# Altium project XC7A35T底板.PrjPcb
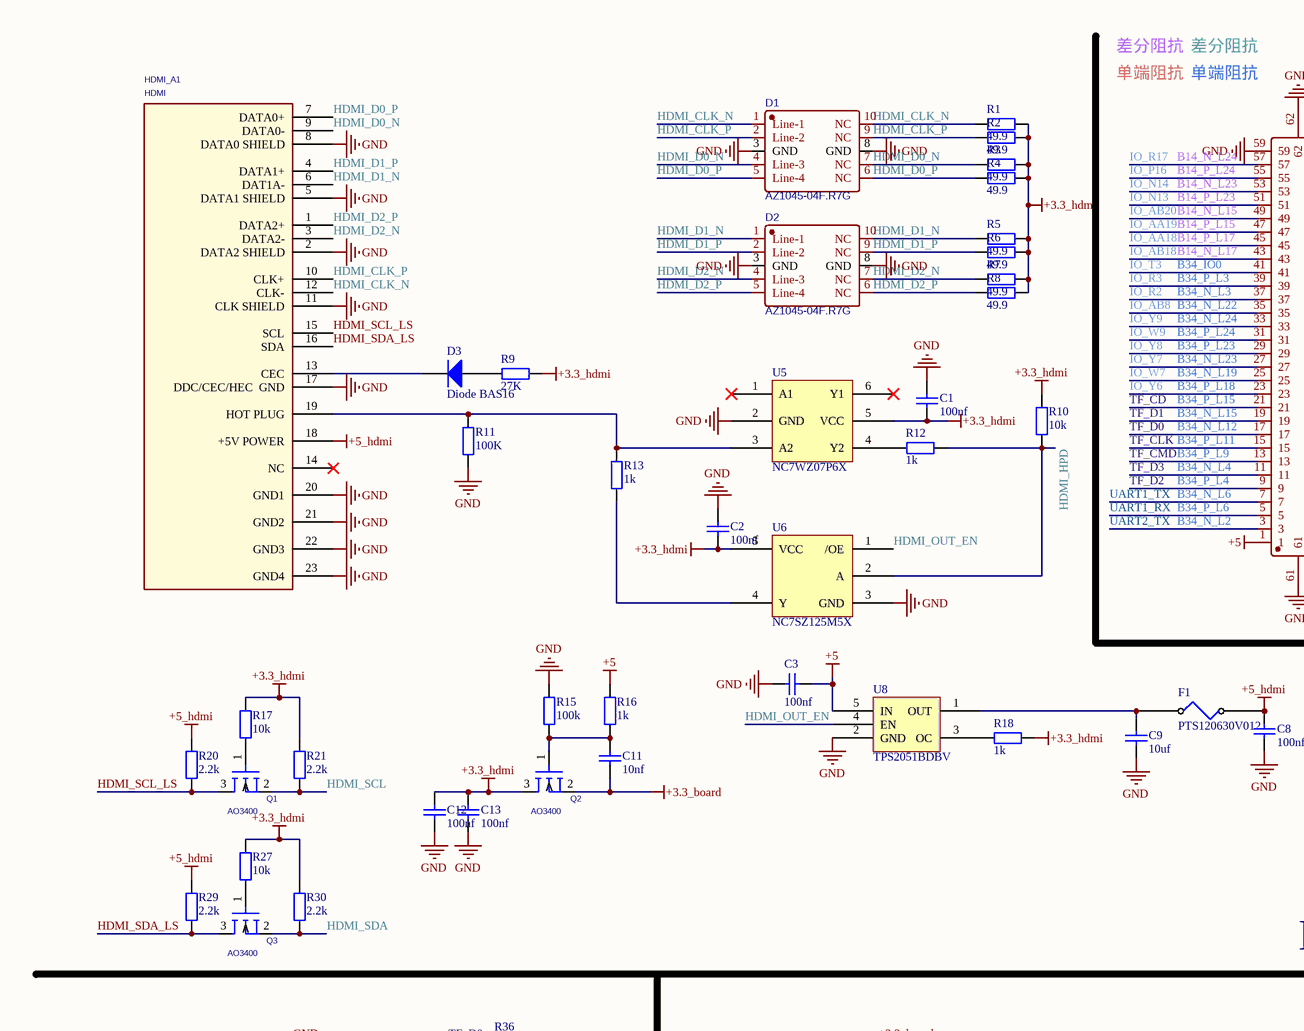
[diagram p0: Sheet1.SchDoc, top left]
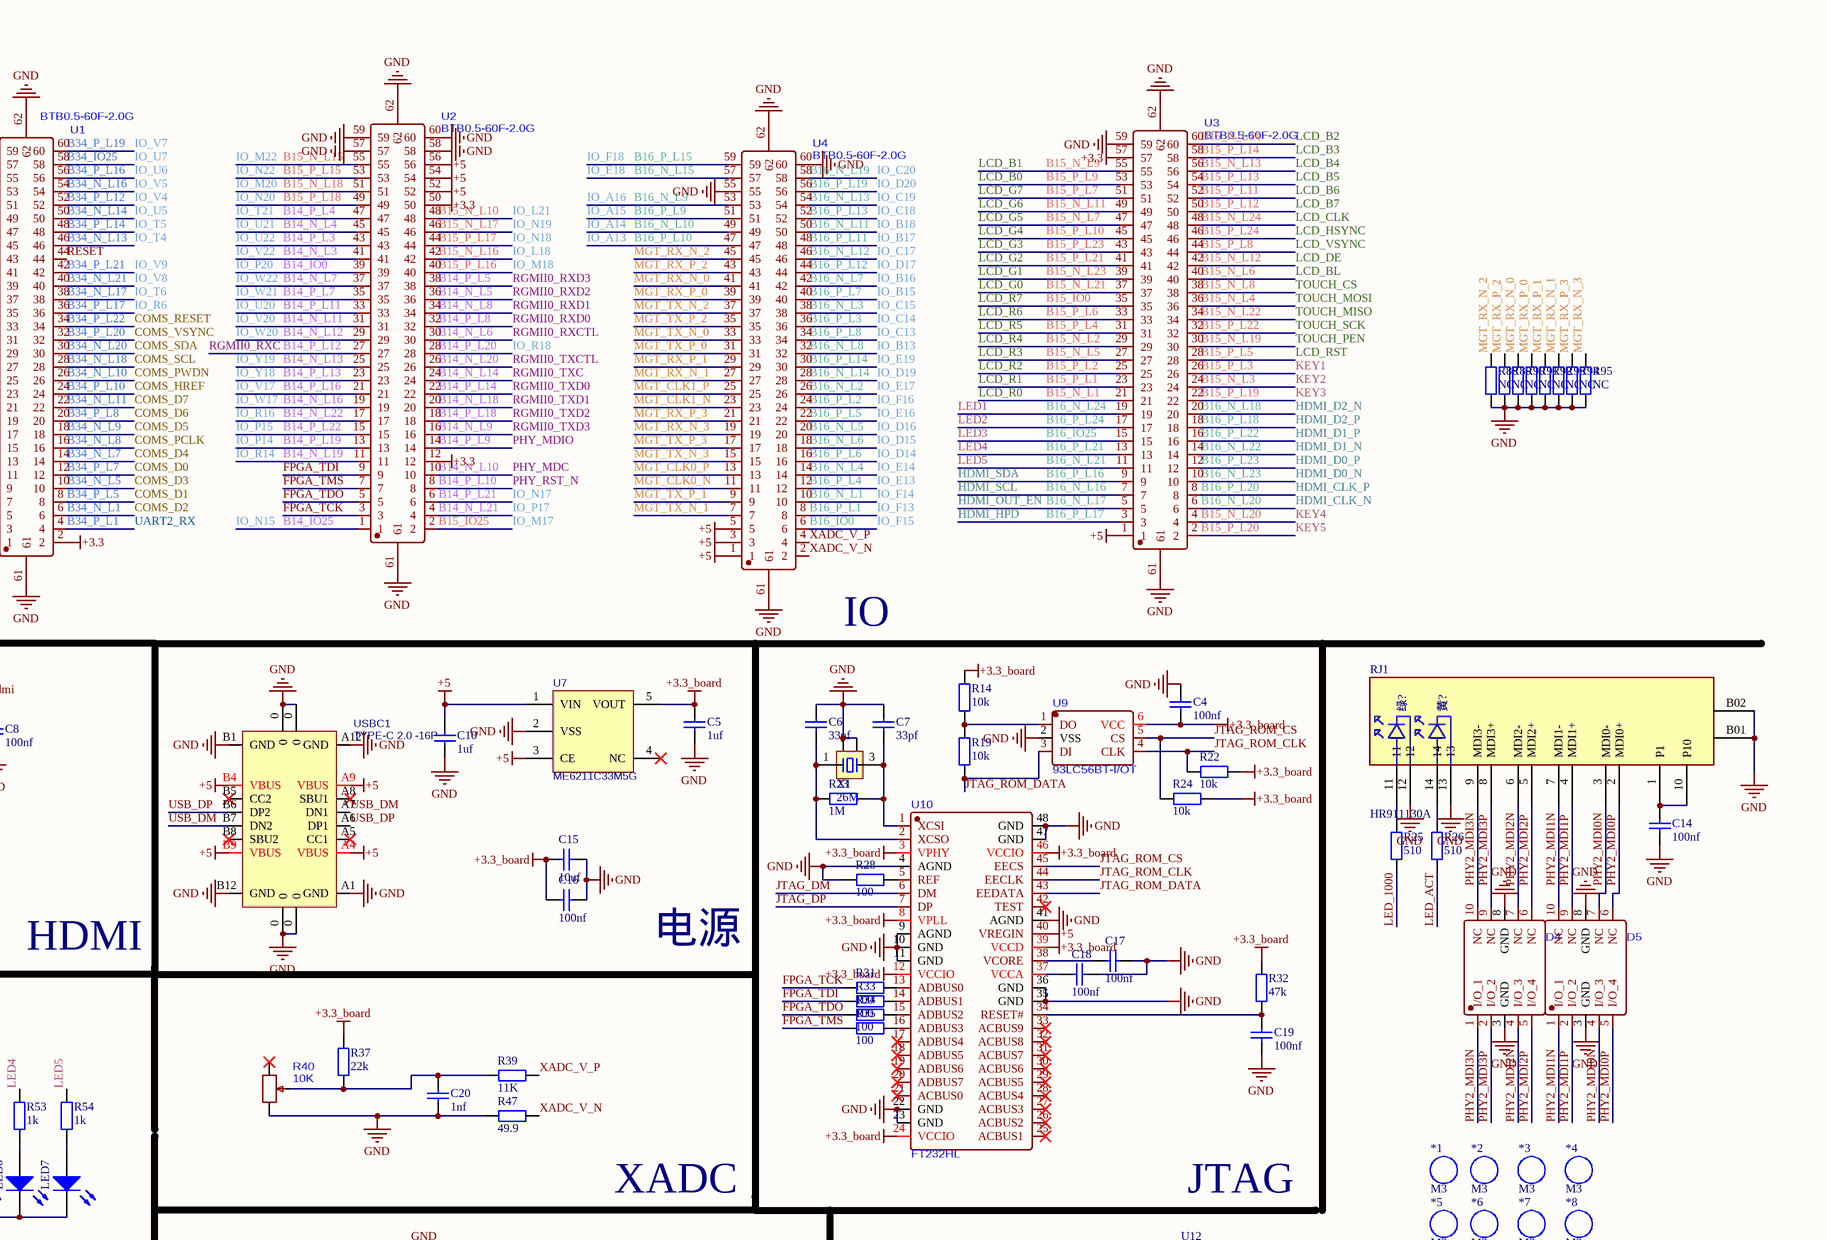
[diagram p1: Sheet1.SchDoc, top right]
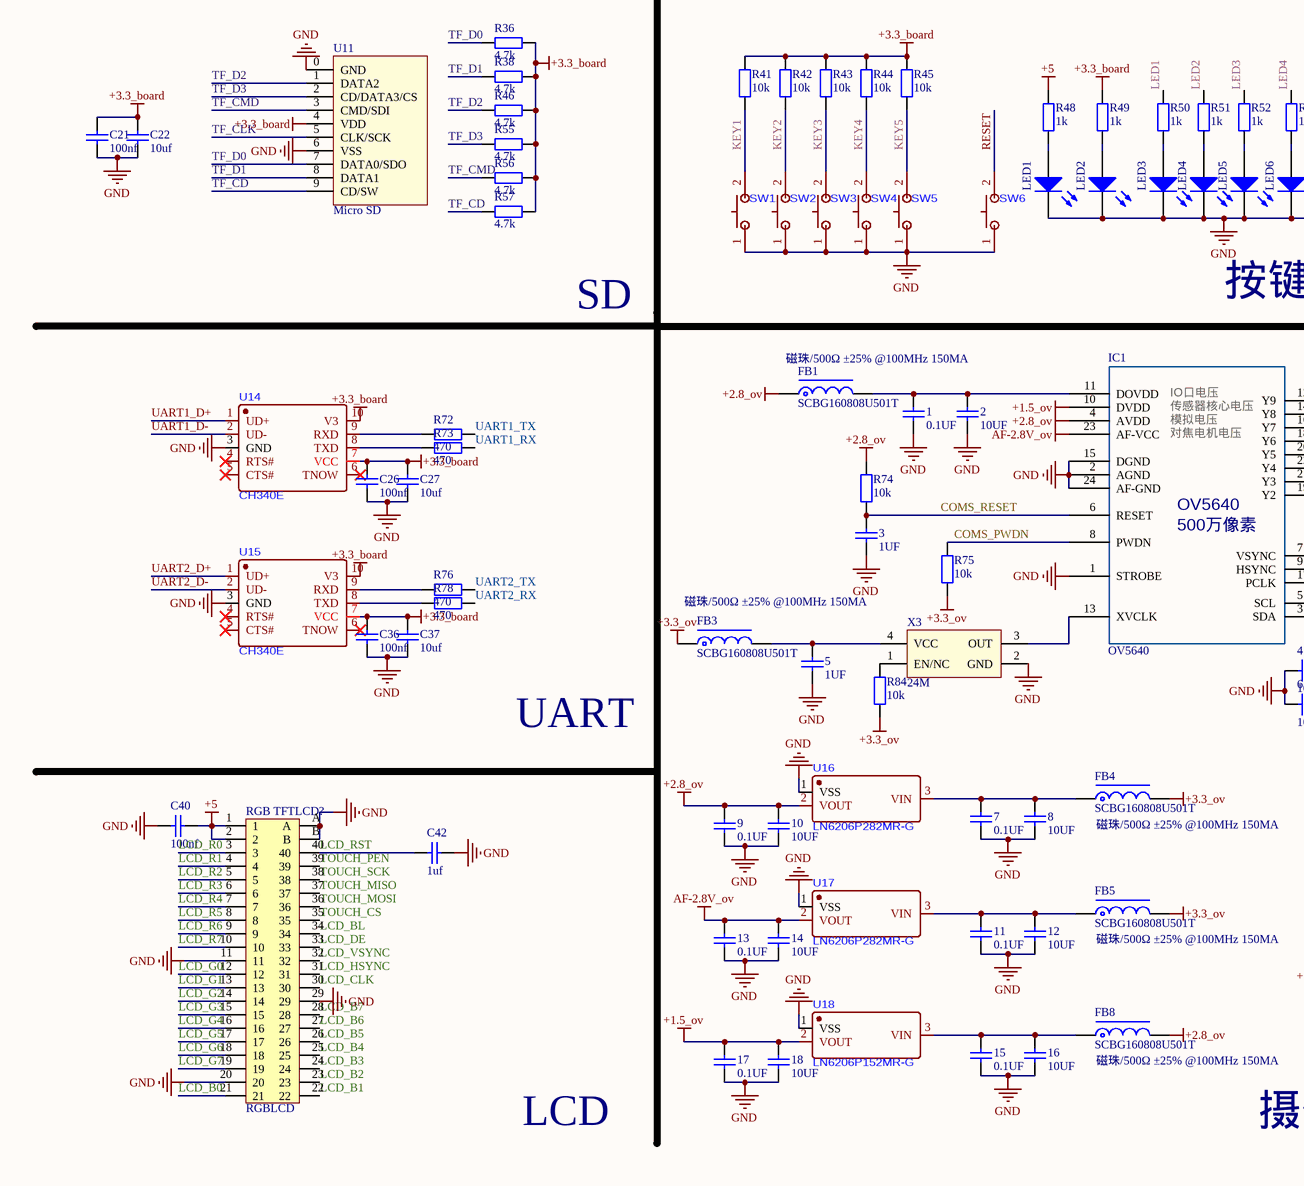
[diagram p2: Sheet1.SchDoc, bottom left]
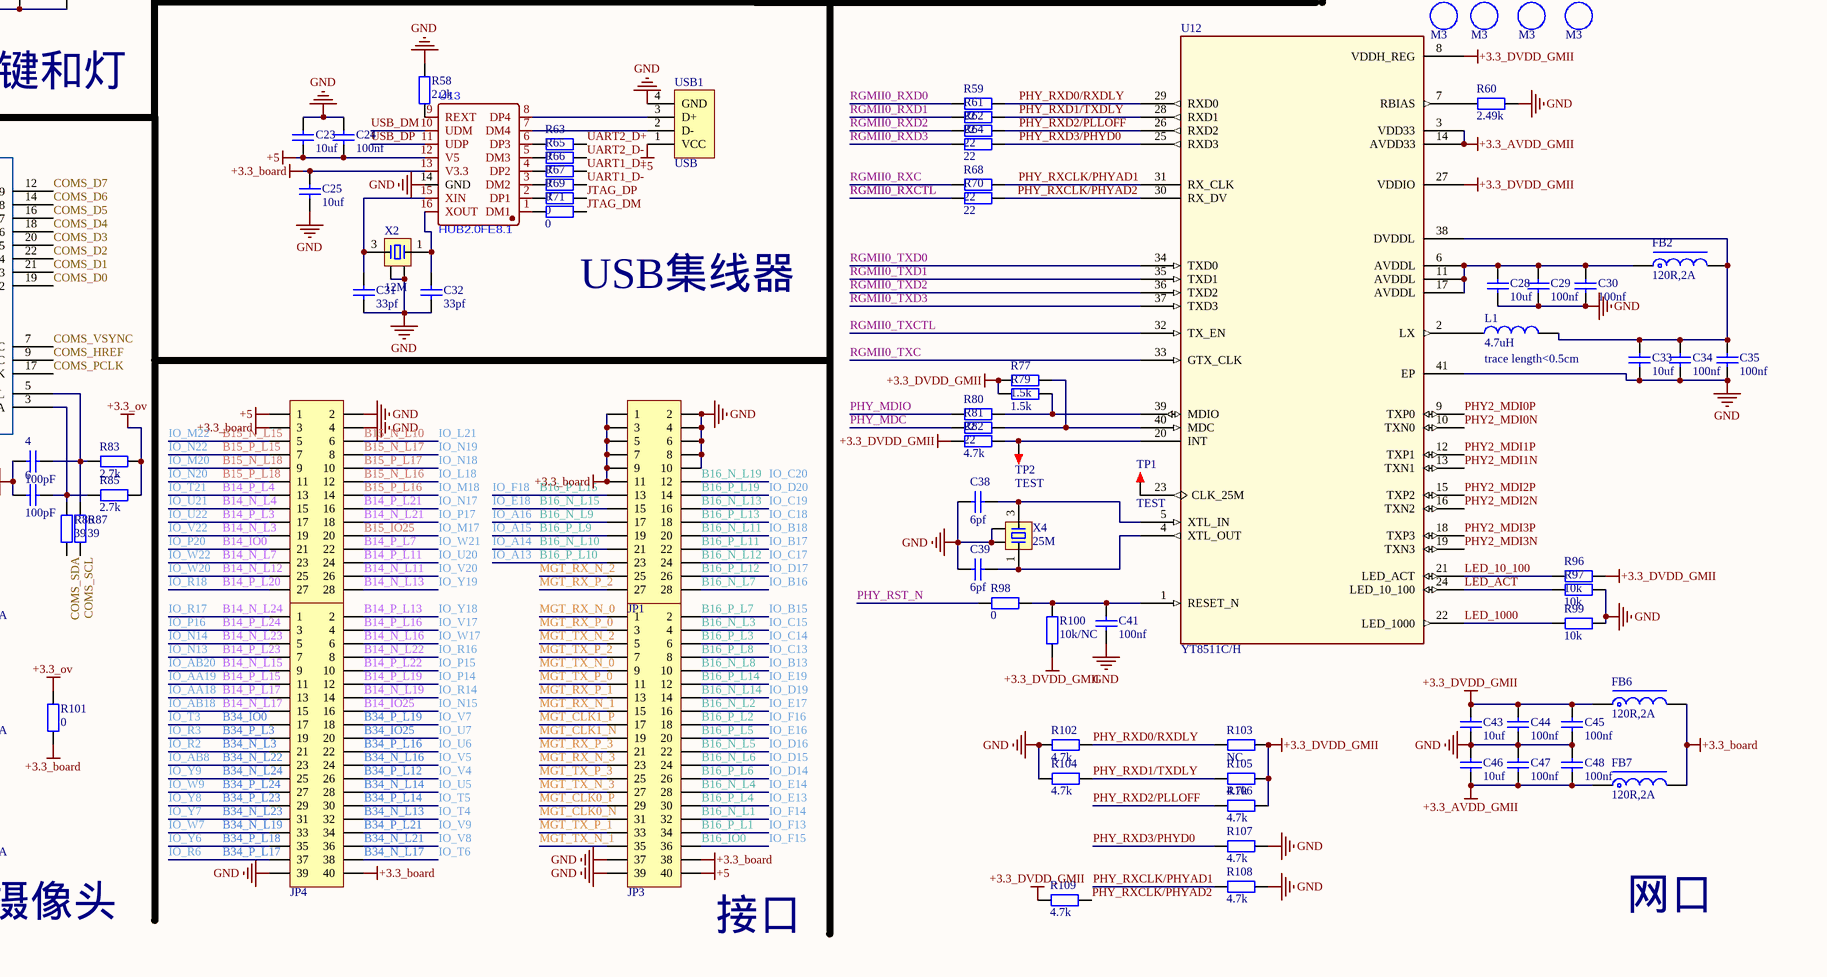
[diagram p3: Sheet1.SchDoc, bottom right]
1 sheet, 248 parts. Net scope: global (net labels, ports and power ports of the same name join across sheets).
Board file: PCB1.PcbDoc

## Sheet Sheet1.SchDoc
size A2; SheetNumber: 1; SheetTotal: 1

### Parts
1  0.1UF  [C0603_L]
2  10UF  [C0603_L]
3  1UF  [C0603_L]
4  100pF  [C0603_L]
5  1UF  [C0603_L]
6  100pF  [C0603_L]
7  0.1UF  [C0603_L]
8  10UF  [C0603_L]
9  0.1UF  [C0603_L]
10  10UF  [C0603_L]
11  0.1UF  [C0603_L]
12  10UF  [C0603_L]
13  0.1UF  [C0603_L]
14  10UF  [C0603_L]
15  0.1UF  [C0603_L]
16  10UF  [C0603_L]
17  0.1UF  [C0603_L]
18  10UF  [C0603_L]
*1  M3  [M3 125X200]
*2  M3  [M3 125X200]
*3  M3  [M3 125X200]
*4  M3  [M3 125X200]
*5  M3  [M3 125X200]
*6  M3  [M3 125X200]
*7  M3  [M3 125X200]
*8  M3  [M3 125X200]
C1  100nf  [C0603_L]
C2  100nf  [C0603_L]
C3  100nf  [C0603_L]
C4  100nf  [C0603_L]
C5  1uf  [C0603_L]
C6  33pf  [C0603_L]
C7  33pf  [C0603_L]
C8  100nf  [C0603_L]
C9  10uf  [C0603_L]
C10  1uf  [C0603_L]
C11  10nf  [C0603_L]
C12  100nf  [C0603_L]
C13  100nf  [C0603_L]
C14  100nf  [C0402_L]
C15  10uf  [C0603_L]
C16  100nf  [C0603_L]
C17  100nf  [C0603_L]
C18  100nf  [C0603_L]
C19  100nf  [C0603_L]
C20  1nf  [C0603_L]
C21  100nf  [C0603_L]
C22  10uf  [C0603_L]
C23  10uf  [C0603_L]
C24  100nf  [C0603_L]
C25  10uf  [C0603_L]
C26  100nf  [C0603_L]
C27  10uf  [C0603_L]
C28  10uf  [C0402_L]
C29  100nf  [C0402_L]
C30  100nf  [C0402_L]
C31  33pf  [C0603_L]
C32  33pf  [C0603_L]
C33  10uf  [C0402_L]
C34  100nf  [C0402_L]
C35  100nf  [C0402_L]
C36  100nf  [C0603_L]
C37  10uf  [C0603_L]
C38  6pf  [C0402_L]
C39  6pf  [C0402_L]
C40  100nf  [C0603_L]
C41  100nf  [C0402_L]
C42  1uf  [C0603_L]
C43  10uf  [C0603_L]
C44  100nf  [C0402_L]
C45  100nf  [C0402_L]
C46  10uf  [C0603_L]
C47  100nf  [C0402_L]
C48  100nf  [C0402_L]
D1  AZ1045-04F.R7G  [DFN2510P10E]
D2  AZ1045-04F.R7G  [DFN2510P10E]
D3  Diode BAS16  [SOT-23_N]
D4  AZ1143-04F_C42377645  [DFN-10_L2.5-W1.0-P0.50-BL-A]  (value not drawn)
D5  AZ1143-04F_C42377645  [DFN-10_L2.5-W1.0-P0.50-BL-A]  (value not drawn)
F1  PTS120630V012  [FU 1206]
FB1  SCBG160808U501T  [FB0603]
FB2  120R,2A  [FB0603]
FB3  SCBG160808U501T  [FB0603]
FB4  SCBG160808U501T  [FB0603]
FB5  SCBG160808U501T  [FB0603]
FB6  120R,2A  [FB0603]
FB7  120R,2A  [FB0603]
FB8  SCBG160808U501T  [FB0603]
HDMI_A1  HDMI  [HDMI_SMD_A]
IC1  OV5640  [OV2640]
JP1  Header 2X11  [HDR2.54-LI-2x14P]  (value not drawn)
JP2  Header 2X11  [HDR2.54-LI-2x14P]  (value not drawn)
JP3  Header 2X11  [HDR2.54-LI-2x20P]  (value not drawn)
JP4  Header 2X11  [HDR2.54-LI-2x20P]  (value not drawn)
L1  4.7uH  [L0805]
LED1  绿色  [LED0805_G]  (value not drawn)
LED2  绿色  [LED0805_G]  (value not drawn)
LED3  绿色  [LED0805_G]  (value not drawn)
LED4  绿色  [LED0805_G]  (value not drawn)
LED5  绿色  [LED0805_G]  (value not drawn)
LED6  绿色  [LED0805_G]  (value not drawn)
LED7  绿色  [LED0805_G]  (value not drawn)
Q1  AO3400  [SOT23]
Q2  AO3400  [SOT23]
Q3  AO3400  [SOT23]
R1  49.9  [R0402_M]
R2  49.9  [R0402_M]
R3  49.9  [R0402_M]
R4  49.9  [R0402_M]
R5  49.9  [R0402_M]
R6  49.9  [R0402_M]
R7  49.9  [R0402_M]
R8  49.9  [R0402_M]
R9  27K  [R0603_L]
R10  10k  [R0603_L]
R11  100K  [R0603_L]
R12  1k  [R0603_L]
R13  1k  [R0603_L]
R14  10k  [R0603_L]
R15  100k  [R0603_L]
R16  1k  [R0603_L]
R17  10k  [R0603_L]
R18  1k  [R0603_L]
R19  10k  [R0603_L]
R20  2.2k  [R0603_L]
R21  2.2k  [R0603_L]
R22  10k  [R0603_L]
R23  1M  [R0603_L]
R24  10k  [R0603_L]
R25  510  [R0402_L]
R26  510  [R0402_L]
R27  10k  [R0603_L]
R28  100  [R0603_L]
R29  2.2k  [R0603_L]
R30  2.2k  [R0603_L]
R31  100  [R0603_L]
R32  47k  [R0603_L]
R33  100  [R0603_L]
R34  100  [R0603_L]
R35  100  [R0603_L]
R36  4.7k  [R0603_L]
R37  22k  [R0603_L]
R38  4.7k  [R0603_L]
R39  11K  [R0603_L]
R40  10K  [RV09_RV0932]
R41  10k  [R0603_L]
R42  10k  [R0603_L]
R43  10k  [R0603_L]
R44  10k  [R0603_L]
R45  10k  [R0603_L]
R46  4.7k  [R0603_L]
R47  49.9  [R0603_L]
R48  1k  [R0603_L]
R49  1k  [R0603_L]
R50  1k  [R0603_L]
R51  1k  [R0603_L]
R52  1k  [R0603_L]
R53  1k  [R0603_L]
R54  1k  [R0603_L]
R55  4.7k  [R0603_L]
R56  4.7k  [R0603_L]
R57  4.7k  [R0603_L]
R58  2.2k  [R0603_L]
R59  22  [R0402_L]
R60  2.49k  [R0402_L]
R61  22  [R0402_L]
R62  22  [R0402_L]
R63  0  [R0603_L]
R64  22  [R0402_L]
R65  0  [R0603_L]
R66  0  [R0603_L]
R67  0  [R0603_L]
R68  22  [R0402_L]
R69  0  [R0603_L]
R70  22  [R0402_L]
R71  0  [R0603_L]
R72  470  [R0603_L]
R73  470  [R0603_L]
R74  10k  [R0603_L]
R75  10k  [R0603_L]
R76  470  [R0603_L]
R77  1.5k  [R0402_L]
R78  470  [R0603_L]
R79  1.5k  [R0402_L]
R80  22  [R0402_L]
R81  22  [R0402_L]
R82  4.7k  [R0402_L]
R83  2.7k  [R0603_L]
R84  10k  [R0603_L]
R85  2.7k  [R0603_L]
R86  39  [R0603_L]
R87  39  [R0603_L]
R88  NC  [R0402_L]
R89  NC  [R0402_L]
R90  NC  [R0402_L]
R91  NC  [R0402_L]
R92  NC  [R0402_L]
R93  NC  [R0402_L]
R94  NC  [R0402_L]
R95  NC  [R0402_L]
R96  10k  [R0402_L]
R97  10k  [R0402_L]
R98  0  [R0402_L]
R99  10k  [R0402_L]
R100  10k/NC  [R0402_L]
R101  0  [R0805_L]
R102  4.7k  [R0402_L]
R103  NC  [R0402_L]
R104  4.7k  [R0402_L]
R105  4.7k  [R0402_L]
R106  4.7k  [R0402_L]
R107  4.7k  [R0402_L]
R108  4.7k  [R0402_L]
R109  4.7k  [R0402_L]
RGB_TFTLCD?  RGBLCD  [FPC-TOP40]
RJ1  HR911130A  [HR911130C_RJ45]
SW1  GT-TC029B-H020-L1N  [SW-SMD_L3.9-W2.9-P4.15-LS5.0]  (value not drawn)
SW2  GT-TC029B-H020-L1N  [SW-SMD_L3.9-W2.9-P4.15-LS5.0]  (value not drawn)
SW3  GT-TC029B-H020-L1N  [SW-SMD_L3.9-W2.9-P4.15-LS5.0]  (value not drawn)
SW4  GT-TC029B-H020-L1N  [SW-SMD_L3.9-W2.9-P4.15-LS5.0]  (value not drawn)
SW5  GT-TC029B-H020-L1N  [SW-SMD_L3.9-W2.9-P4.15-LS5.0]  (value not drawn)
SW6  GT-TC029B-H020-L1N  [SW-SMD_L3.9-W2.9-P4.15-LS5.0]  (value not drawn)
TP1  TEST  [TEST 1.6]
TP2  TEST  [TEST 1.6]
U1  BTB0.5-60F-2.0G  [CONN-SMD_60P-P0.50_BTB0.5-60F-2.0G]
U2  BTB0.5-60F-2.0G  [CONN-SMD_60P-P0.50_BTB0.5-60F-2.0G]
U3  BTB0.5-60F-2.0G  [CONN-SMD_60P-P0.50_BTB0.5-60F-2.0G]
U4  BTB0.5-60F-2.0G  [CONN-SMD_60P-P0.50_BTB0.5-60F-2.0G]
U5  NC7WZ07P6X  [NC7WZ07P6X]
U6  NC7SZ125M5X  [NC7SZ125M5X]
U7  ME6211C33M5G  [SOT-23-5]
U8  TPS2051BDBV  [TPS2051BDBV]
U9  93LC56BT-I/OT  [SOT-23-6_L2.9-W1.6-P0.95-LS2.8-BR]
U10  FT232HL  [LQFP-48_L7.0-W7.0-P0.50-LS9.0-TL]
U11  Micro SD  [Micro SD]
U12  YT8511C/H  [QFN40 5X5_N]
U13  HUB2.0FE8.1  [SSOP-16_L4.9-W3.9-P0.64-LS6.0-BL]
U14  CH340E  [MSOP-10_L3.0-W3.0-P0.50-LS5.0-BL]
U15  CH340E  [MSOP-10_L3.0-W3.0-P0.50-LS5.0-BL]
U16  LN6206P282MR-G  [SOT-23-3_L2.9-W1.3-P1.90-LS2.4-BR]
U17  LN6206P282MR-G  [SOT-23-3_L2.9-W1.3-P1.90-LS2.4-BR]
U18  LN6206P152MR-G  [SOT-23-3_L2.9-W1.3-P1.90-LS2.4-BR]
USB1  USB  [USB2.0_Type-A_DIP_F_1]
USBC1  TYPE-C 2.0 -16P  [USB-C-SMD_16P]
X1  26M  [XTAL-3225-4P]
X2  12M  [XTAL-3225-4P]
X3  24M  [OSC-3225-4P]
X4  25M  [XTAL-3225-4P]

### Nets
+1.5_ov: 17.2 18.2 IC1.10(DVDD) U18.2(VOUT)
+2.8_ov: 9.2 10.2 FB1.1 FB8.2 IC1.4(AVDD) R74.1 U16.2(VOUT)
+3.3: U1.2 U2.12 U2.50 U3.57
+3.3_AVDD_GMII: C46.2 C47.2 C48.2 FB7.1 U12.3(VDD33) U12.14(AVDD33)
+3.3_board: C4.2 C5.2 C11.1 C15.2 C16.2 C21.2 C22.2 C25.1 C26.2 C27.2 C36.2 C37.2 FB6.2 FB7.2 JP1.1 JP1.3 JP1.5 JP1.7 JP1.9 JP1.11 JP2.3 JP3.38 JP4.40 Q2.2(S) R14.2 R22.1 R24.1 R32.2 R36.2 R37.2 R38.2 R41.2 R42.2 R43.2 R44.2 R45.2 R46.2 R49.2 R55.2 R56.2 R57.2 R101.1 U7.5(VOUT) U9.6(VCC) U10.3(VPHY) U10.8(VPLL) U10.12(VCCIO) U10.24(VCCIO) U10.39(VCCD) U10.46(VCCIO) U11.4(VDD) U13.13(V3.3) U14.7(VCC) U14.10(V3) U15.7(VCC) U15.10(V3)
+3.3_DVDD_GMII: C43.1 C44.1 C45.1 FB6.1 R77.1 R79.1 R82.1 R96.2 R100.1 R103.2 R105.2 R106.2 R109.1 U12.8(VDDH_REG) U12.27(VDDIO)
+3.3_hdmi: C1.1 C2.2 C12.2 C13.2 Q2.3(D) R1.2 R2.2 R3.2 R4.2 R5.2 R6.2 R7.2 R8.2 R9.2 R10.2 R17.1 R18.1 R21.1 R27.1 R30.1 U5.5(VCC) U6.5(VCC)
+3.3_ov: FB3.1 FB4.2 FB5.2 R75.2 R83.2 R84.2 R85.2 R101.2
+5: C3.2 C10.2 C23.2 C24.2 C40.2 JP2.1 JP3.40 R16.2 R48.2 RGB_TFTLCD?.1 RGB_TFTLCD?.2 U1.1 U2.52 U2.54 U2.56 U3.1 U4.1 U4.3 U4.5 U7.1(VIN) U7.3(CE) U8.5(IN) U10.40(VREGIN) U13.12(V5) USB1.1(VCC) USBC1.A4(VBUS) USBC1.A9(VBUS) USBC1.B4(VBUS) USBC1.B9(VBUS)
+5_hdmi: C8.2 F1.2 HDMI_A1.18(+5V_POWER) R20.1 R29.1
AF-2.8V_ov: 13.2 14.2 IC1.23(AF-VCC) U17.2(VOUT)
GND: 1.1 2.1 3.1 4.1 5.1 6.1 7.1 8.1 9.1 10.1 11.1 12.1 13.1 14.1 15.1 16.1 17.1 18.1 C1.2 C2.1 C3.1 C4.1 C5.1 C6.2 C7.2 C8.1 C9.1 C10.1 C12.1 C13.1 C14.2 C15.1 C16.1 C17.2 C18.2 C19.1 C20.2 C21.1 C22.1 C23.1 C24.1 C25.2 C26.1 C27.1 C28.1 C29.1 C30.1 C31.2 C32.2 C33.1 C34.1 C35.1 C36.1 C37.1 C38.1 C39.1 C40.1 C41.1 C42.2 C43.2 C44.2 C45.2 C46.1 C47.1 C48.1 D1.3(GND) D1.8(GND) D2.3(GND) D2.8(GND) D4.3(GND) D4.8(GND) D5.3(GND) D5.8(GND) HDMI_A1.2(DATA2_SHIELD) HDMI_A1.5(DATA1_SHIELD) HDMI_A1.8(DATA0_SHIELD) HDMI_A1.11(CLK_SHIELD) HDMI_A1.17(DDC/CEC/HEC__GND) HDMI_A1.20(GND1) HDMI_A1.21(GND2) HDMI_A1.22(GND3) HDMI_A1.23(GND4) IC1.1(STROBE) IC1.2(AGND) IC1.15(DGND) IC1.24(AF-GND) JP1.2 JP1.4 JP1.6 JP1.8 JP1.10 JP2.2 JP2.4 JP3.37 JP3.39 JP4.39 LED1.2(K) LED2.2(K) LED3.2(K) LED4.2(K) LED5.2(K) LED6.2(K) LED7.2(K) R11.1 R15.1 R28.1 R40.1 R47.1 R58.1 R60.2 R88.1 R89.1 R90.1 R91.1 R92.1 R93.1 R94.1 R95.1 R97.2 R99.2 R102.1 R104.1 R107.2 R108.2 RGB_TFTLCD?.11 RGB_TFTLCD?.20 RGB_TFTLCD?.29 RGB_TFTLCD?.A RGB_TFTLCD?.B RJ1.12 RJ1.13 RJ1.B01 RJ1.B02 SW1.1 SW2.1 SW3.1 SW4.1 SW5.1 SW6.1 U1.59 U1.61 U1.62 U2.57 U2.58 U2.59 U2.60 U2.61 U2.62 U3.59 U3.61 U3.62 U4.55 U4.60 U4.61 U4.62 U5.2(GND) U6.3(GND) U7.2(VSS) U8.2(GND) U9.2(VSS) U10.4(AGND) U10.9(AGND) U10.10(GND) U10.11(GND) U10.22(GND) U10.23(GND) U10.35(GND) U10.36(GND) U10.41(AGND) U10.47(GND) U10.48(GND) U11.0(GND) U11.6(VSS) U12.41(EP) U13.14(GND) U14.3(GND) U15.3(GND) U16.1(VSS) U17.1(VSS) U18.1(VSS) USB1.4(GND) USBC1.0 USBC1.A1(GND) USBC1.A12(GND) USBC1.B1(GND) USBC1.B12(GND) X1.2 X1.4 X2.2 X2.4 X3.2(GND) X4.2 X4.4
B14_IO0: JP2.21 U2.39  [also labelled IO_P20]
B14_IO25: JP4.16 U2.1  [also labelled IO_N15]
B14_N_L3: JP2.19 U2.41  [also labelled IO_V22]
B14_N_L4: JP2.15 U2.45  [also labelled IO_U21]
B14_N_L5: R62.1 U2.36  [also labelled RGMII0_RXD2]
B14_N_L6: R70.1 U2.30  [also labelled RGMII0_RXCTL]
B14_N_L7: JP2.23 U2.37  [also labelled IO_W22]
B14_N_L8: R61.1 U2.34  [also labelled RGMII0_RXD1]
B14_N_L9: U2.16 U12.37(TXD3)  [also labelled RGMII0_TXD3]
B14_N_L10: R81.1 U2.10  [also labelled PHY_MDC]
B14_N_L11: JP2.26 U2.31  [also labelled IO_V20]
B14_N_L12: JP2.25 U2.29  [also labelled IO_W20]
B14_N_L13: JP2.28 U2.25  [also labelled IO_Y19]
B14_N_L14: U2.24 U12.33(GTX_CLK)  [also labelled RGMII0_TXC]
B14_N_L15: JP4.9 U1.49  [also labelled IO_AB20]
B14_N_L16: JP4.6 U2.19  [also labelled IO_W17]
B14_N_L17: JP4.15 U1.43  [also labelled IO_AB18]
B14_N_L18: U2.20 U12.35(TXD1)  [also labelled RGMII0_TXD1]
B14_N_L19: JP4.14 U2.11  [also labelled IO_R14]
B14_N_L20: U2.26 U12.32(TX_EN)  [also labelled RGMII0_TXCTL]
B14_N_L21: JP2.18 U2.4  [also labelled IO_P17]
B14_N_L22: JP4.8 U2.17  [also labelled IO_R16]
B14_N_L23: JP4.5 U1.53  [also labelled IO_N14]
B14_N_L24: JP4.1 U1.57  [also labelled IO_R17]
B14_P_L3: JP2.17 U2.43  [also labelled IO_U22]
B14_P_L4: JP2.13 U2.47  [also labelled IO_T21]
B14_P_L5: R64.1 U2.38  [also labelled RGMII0_RXD3]
B14_P_L7: JP2.22 U2.35  [also labelled IO_W21]
B14_P_L8: R59.1 U2.32  [also labelled RGMII0_RXD0]
B14_P_L9: R80.1 U2.14  [also labelled PHY_MDIO]
B14_P_L10: R98.1 U2.8  [also labelled PHY_RST_N]
B14_P_L11: JP2.24 U2.33  [also labelled IO_U20]
B14_P_L12: R68.1 U2.27  [also labelled RGMII0_RXC]
B14_P_L13: JP4.2 U2.23  [also labelled IO_Y18]
B14_P_L14: U2.22 U12.34(TXD0)  [also labelled RGMII0_TXD0]
B14_P_L15: JP4.11 U1.47  [also labelled IO_AA19]
B14_P_L16: JP4.4 U2.21  [also labelled IO_V17]
B14_P_L17: JP4.13 U1.45  [also labelled IO_AA18]
B14_P_L18: U2.18 U12.36(TXD2)  [also labelled RGMII0_TXD2]
B14_P_L19: JP4.12 U2.13  [also labelled IO_P14]
B14_P_L20: JP2.27 U2.28  [also labelled IO_R18]
B14_P_L21: JP2.16 U2.6  [also labelled IO_N17]
B14_P_L22: JP4.10 U2.15  [also labelled IO_P15]
B14_P_L23: JP4.7 U1.51  [also labelled IO_N13]
B14_P_L24: JP4.3 U1.55  [also labelled IO_P16]
B15_IO0: RGB_TFTLCD?.10 U3.35  [also labelled LCD_R7]
B15_IO25: JP2.20 U2.2  [also labelled IO_M17]
B15_N_L1: RGB_TFTLCD?.3 U3.21  [also labelled LCD_R0]
B15_N_L2: RGB_TFTLCD?.7 U3.29  [also labelled LCD_R4]
B15_N_L3: R42.1 SW2.2 U3.24  [also labelled KEY2]
B15_N_L4: RGB_TFTLCD?.36 U3.36  [also labelled TOUCH_MOSI]
B15_N_L5: RGB_TFTLCD?.6 U3.27  [also labelled LCD_R3]
B15_N_L6: RGB_TFTLCD?.34 U3.40  [also labelled LCD_BL]
B15_N_L7: RGB_TFTLCD?.17 U3.47  [also labelled LCD_G5]
B15_N_L8: RGB_TFTLCD?.35 U3.38  [also labelled TOUCH_CS]
B15_N_L9: RGB_TFTLCD?.22 U3.55  [also labelled LCD_B1]
B15_N_L10: JP2.6 U2.48  [also labelled IO_L21]
B15_N_L11: RGB_TFTLCD?.18 U3.49  [also labelled LCD_G6]
B15_N_L12: RGB_TFTLCD?.33 U3.42  [also labelled LCD_DE]
B15_N_L13: RGB_TFTLCD?.25 U3.56  [also labelled LCD_B4]
B15_N_L14: RGB_TFTLCD?.23 U3.60  [also labelled LCD_B2]
B15_N_L15: JP2.5 U2.55  [also labelled IO_M22]
B15_N_L16: JP2.12 U2.42  [also labelled IO_L18]
B15_N_L17: JP2.8 U2.46  [also labelled IO_N19]
B15_N_L18: JP2.9 U2.51  [also labelled IO_M20]
B15_N_L19: RGB_TFTLCD?.39 U3.30  [also labelled TOUCH_PEN]
B15_N_L20: R44.1 SW4.2 U3.4  [also labelled KEY4]
B15_N_L21: RGB_TFTLCD?.12 U3.37  [also labelled LCD_G0]
B15_N_L22: RGB_TFTLCD?.37 U3.34  [also labelled TOUCH_MISO]
B15_N_L23: RGB_TFTLCD?.13 U3.39  [also labelled LCD_G1]
B15_N_L24: RGB_TFTLCD?.30 U3.48  [also labelled LCD_CLK]
B15_P_L1: RGB_TFTLCD?.4 U3.23  [also labelled LCD_R1]
B15_P_L2: RGB_TFTLCD?.5 U3.25  [also labelled LCD_R2]
B15_P_L3: R41.1 SW1.2 U3.26  [also labelled KEY1]
B15_P_L4: RGB_TFTLCD?.8 U3.31  [also labelled LCD_R5]
B15_P_L5: C42.1 RGB_TFTLCD?.40 U3.28  [also labelled LCD_RST]
B15_P_L6: RGB_TFTLCD?.9 U3.33  [also labelled LCD_R6]
B15_P_L7: RGB_TFTLCD?.19 U3.51  [also labelled LCD_G7]
B15_P_L8: RGB_TFTLCD?.32 U3.44  [also labelled LCD_VSYNC]
B15_P_L9: RGB_TFTLCD?.21 U3.53  [also labelled LCD_B0]
B15_P_L10: RGB_TFTLCD?.16 U3.45  [also labelled LCD_G4]
B15_P_L11: RGB_TFTLCD?.27 U3.52  [also labelled LCD_B6]
B15_P_L12: RGB_TFTLCD?.28 U3.50  [also labelled LCD_B7]
B15_P_L13: RGB_TFTLCD?.26 U3.54  [also labelled LCD_B5]
B15_P_L14: RGB_TFTLCD?.24 U3.58  [also labelled LCD_B3]
B15_P_L15: JP2.7 U2.53  [also labelled IO_N22]
B15_P_L16: JP2.14 U2.40  [also labelled IO_M18]
B15_P_L17: JP2.10 U2.44  [also labelled IO_N18]
B15_P_L18: JP2.11 U2.49  [also labelled IO_N20]
B15_P_L19: R43.1 SW3.2 U3.22  [also labelled KEY3]
B15_P_L20: R45.1 SW5.2 U3.2  [also labelled KEY5]
B15_P_L21: RGB_TFTLCD?.14 U3.41  [also labelled LCD_G2]
B15_P_L22: RGB_TFTLCD?.38 U3.32  [also labelled TOUCH_SCK]
B15_P_L23: RGB_TFTLCD?.15 U3.43  [also labelled LCD_G3]
B15_P_L24: RGB_TFTLCD?.31 U3.46  [also labelled LCD_HSYNC]
B16_IO0: JP3.36 U4.6  [also labelled IO_F15]
B16_IO25: R52.2 U3.15  [also labelled LED3]
B16_N_L1: JP3.32 U4.10  [also labelled IO_F14]
B16_N_L2: JP3.16 U4.26  [also labelled IO_E17]
B16_N_L3: JP3.4 U4.38  [also labelled IO_C15]
B16_N_L4: JP3.28 U4.14  [also labelled IO_E14]
B16_N_L5: JP3.22 U4.20  [also labelled IO_D16]
B16_N_L6: JP3.24 U4.18  [also labelled IO_D15]
B16_N_L7: JP1.28 U4.42  [also labelled IO_B16]
B16_N_L8: JP3.10 U4.32  [also labelled IO_B13]
B16_N_L9: JP1.17 U4.53  [also labelled IO_A16]
B16_N_L10: JP1.21 U4.49  [also labelled IO_A14]
B16_N_L11: JP1.20 U4.50  [also labelled IO_B18]
B16_N_L12: JP1.24 U4.46  [also labelled IO_C17]
B16_N_L13: JP1.16 U4.54  [also labelled IO_C19]
B16_N_L14: JP3.14 U4.28  [also labelled IO_D19]
B16_N_L15: JP1.15 U4.57  [also labelled IO_E18]
B16_N_L16: Q1.2(S) R21.2 U3.7  [also labelled HDMI_SCL]
B16_N_L17: U3.5 U6.1(/OE) U8.4(EN)  [also labelled HDMI_OUT_EN]
B16_N_L18: D2.4(Line-3) D2.7(NC) HDMI_A1.3(DATA2-) R7.1 U3.20  [also labelled HDMI_D2_N]
B16_N_L19: JP1.12 U4.58  [also labelled IO_C20]
B16_N_L20: D1.1(Line-1) D1.10(NC) HDMI_A1.12(CLK-) R1.1 U3.6  [also labelled HDMI_CLK_N]
B16_N_L21: R54.2 U3.11  [also labelled LED5]
B16_N_L22: D2.1(Line-1) D2.10(NC) HDMI_A1.6(DAT1A-) R5.1 U3.14  [also labelled HDMI_D1_N]
B16_N_L23: D1.4(Line-3) D1.7(NC) HDMI_A1.9(DATA0-) R3.1 U3.10  [also labelled HDMI_D0_N]
B16_N_L24: R50.2 U3.19  [also labelled LED1]
B16_P_L1: JP3.34 U4.8  [also labelled IO_F13]
B16_P_L2: JP3.18 U4.24  [also labelled IO_F16]
B16_P_L3: JP3.6 U4.36  [also labelled IO_C14]
B16_P_L4: JP3.30 U4.12  [also labelled IO_E13]
B16_P_L5: JP3.20 U4.22  [also labelled IO_E16]
B16_P_L6: JP3.26 U4.16  [also labelled IO_D14]
B16_P_L7: JP3.2 U4.40  [also labelled IO_B15]
B16_P_L8: JP3.8 U4.34  [also labelled IO_C13]
B16_P_L9: JP1.19 U4.51  [also labelled IO_A15]
B16_P_L10: JP1.23 U4.47  [also labelled IO_A13]
B16_P_L11: JP1.22 U4.48  [also labelled IO_B17]
B16_P_L12: JP1.26 U4.44  [also labelled IO_D17]
B16_P_L13: JP1.18 U4.52  [also labelled IO_C18]
B16_P_L14: JP3.12 U4.30  [also labelled IO_E19]
B16_P_L15: JP1.13 U4.59  [also labelled IO_F18]
B16_P_L16: Q3.2(S) R30.2 U3.9  [also labelled HDMI_SDA]
B16_P_L17: R10.1 R12.2 U3.3 U6.2(A)  [also labelled HDMI_HPD]
B16_P_L18: D2.5(Line-4) D2.6(NC) HDMI_A1.1(DATA2+) R8.1 U3.18  [also labelled HDMI_D2_P]
B16_P_L19: JP1.14 U4.56  [also labelled IO_D20]
B16_P_L20: D1.2(Line-2) D1.9(NC) HDMI_A1.10(CLK+) R2.1 U3.8  [also labelled HDMI_CLK_P]
B16_P_L21: R53.2 U3.13  [also labelled LED4]
B16_P_L22: D2.2(Line-2) D2.9(NC) HDMI_A1.4(DATA1+) R6.1 U3.16  [also labelled HDMI_D1_P]
B16_P_L23: D1.5(Line-4) D1.6(NC) HDMI_A1.7(DATA0+) R4.1 U3.12  [also labelled HDMI_D0_P]
B16_P_L24: R51.2 U3.17  [also labelled LED2]
B34_IO0: JP4.17 U1.41  [also labelled IO_T3]
B34_IO25: JP4.20 U1.58  [also labelled IO_U7]
B34_N_L1: IC1.22(Y4) U1.6  [also labelled COMS_D2]
B34_N_L2: R76.2 U1.3  [also labelled UART2_TX]
B34_N_L3: JP4.21 U1.37  [also labelled IO_R2]
B34_N_L4: R55.1 U1.11 U11.2(CD/DATA3/CS)  [also labelled TF_D3]
B34_N_L5: IC1.20(Y5) U1.10  [also labelled COMS_D3]
B34_N_L6: R72.2 U1.7  [also labelled UART1_TX]
B34_N_L7: IC1.18(Y6) U1.14  [also labelled COMS_D4]
B34_N_L8: IC1.17(PCLK) U1.16  [also labelled COMS_PCLK]
B34_N_L9: IC1.16(Y7) U1.18  [also labelled COMS_D5]
B34_N_L10: IC1.8(PWDN) R75.1 U1.26  [also labelled COMS_PWDN]
B34_N_L11: IC1.12(Y9) U1.22  [also labelled COMS_D7]
B34_N_L12: R36.1 U1.17 U11.7(DATA0/SDO)  [also labelled TF_D0]
B34_N_L13: JP4.32 U1.46  [also labelled IO_T4]
B34_N_L14: JP4.28 U1.50  [also labelled IO_U5]
B34_N_L15: R38.1 U1.19 U11.8(DATA1)  [also labelled TF_D1]
B34_N_L16: JP4.24 U1.54  [also labelled IO_V5]
B34_N_L17: JP4.38 U1.38  [also labelled IO_T6]
B34_N_L18: R87.2 U1.28  [also labelled COMS_SCL]
B34_N_L19: JP4.33 U1.25  [also labelled IO_W7]
B34_N_L20: R86.2 U1.30  [also labelled COMS_SDA]
B34_N_L21: JP4.36 U1.40  [also labelled IO_V8]
B34_N_L22: JP4.23 U1.35  [also labelled IO_AB8]
B34_N_L23: JP4.31 U1.27  [also labelled IO_Y7]
B34_N_L24: JP4.25 U1.33  [also labelled IO_Y9]
B34_P_L1: R78.2 U1.4  [also labelled UART2_RX]
B34_P_L3: JP4.19 U1.39  [also labelled IO_R3]
B34_P_L4: R46.1 U1.9 U11.1(DATA2)  [also labelled TF_D2]
B34_P_L5: IC1.21(Y3) U1.8  [also labelled COMS_D1]
B34_P_L6: R73.2 U1.5  [also labelled UART1_RX]
B34_P_L7: IC1.19(Y2) U1.12  [also labelled COMS_D0]
B34_P_L8: IC1.14(Y8) U1.20  [also labelled COMS_D6]
B34_P_L9: R56.1 U1.13 U11.3(CMD/SDI)  [also labelled TF_CMD]
B34_P_L10: IC1.9(HSYNC) U1.24  [also labelled COMS_HREF]
B34_P_L11: U1.15 U11.5(CLK/SCK)  [also labelled TF_CLK]
B34_P_L12: JP4.26 U1.52  [also labelled IO_V4]
B34_P_L14: JP4.30 U1.48  [also labelled IO_T5]
B34_P_L15: R57.1 U1.21 U11.9(CD/SW)  [also labelled TF_CD]
B34_P_L16: JP4.22 U1.56  [also labelled IO_U6]
B34_P_L17: JP4.37 U1.36  [also labelled IO_R6]
B34_P_L18: JP4.35 U1.23  [also labelled IO_Y6]
B34_P_L19: JP4.18 U1.60  [also labelled IO_V7]
B34_P_L20: IC1.7(VSYNC) U1.32  [also labelled COMS_VSYNC]
B34_P_L21: JP4.34 U1.42  [also labelled IO_V9]
B34_P_L22: 3.2 IC1.6(RESET) R74.2 U1.34  [also labelled COMS_RESET]
B34_P_L23: JP4.29 U1.29  [also labelled IO_Y8]
B34_P_L24: JP4.27 U1.31  [also labelled IO_W9]
FPGA_TCK: R31.1 U2.3
FPGA_TDI: R33.1 U2.9
FPGA_TDO: R34.1 U2.5
FPGA_TMS: R35.1 U2.7
HDMI_SCL_LS: HDMI_A1.15(SCL) Q1.3(D) R20.2
HDMI_SDA_LS: HDMI_A1.16(SDA) Q3.3(D) R29.2
JTAG_DM: R71.2 U10.6(DM)
JTAG_DP: R69.2 U10.7(DP)
JTAG_ROM_CLK: R22.2 U9.4(CLK) U10.44(EECLK)
JTAG_ROM_CS: R24.2 U9.5(CS) U10.45(EECS)
JTAG_ROM_DATA: R19.1 U9.3(DI) U10.43(EEDATA)
LED_10_100: R96.1 U12.21(LED_ACT)
LED_1000: R25.1 R99.1 U12.22(LED_1000)
LED_ACT: R26.1 R97.1 U12.24(LED_10_100)
MGT_CLK0_N: JP3.31 U4.11
MGT_CLK0_P: JP3.29 U4.13
MGT_CLK1_N: JP3.19 U4.23
MGT_CLK1_P: JP3.17 U4.25
MGT_RX_N_0: JP3.1 R90.2 U4.41
MGT_RX_N_1: JP3.15 R93.2 U4.27
MGT_RX_N_2: JP1.25 R88.2 U4.45
MGT_RX_N_3: JP3.23 R95.2 U4.19
MGT_RX_P_0: JP3.3 R91.2 U4.39
MGT_RX_P_1: JP3.13 R92.2 U4.29
MGT_RX_P_2: JP1.27 R89.2 U4.43
MGT_RX_P_3: JP3.21 R94.2 U4.21
MGT_TX_N_0: JP3.9 U4.33
MGT_TX_N_1: JP3.35 U4.7
MGT_TX_N_2: JP3.5 U4.37
MGT_TX_N_3: JP3.27 U4.15
MGT_TX_P_0: JP3.11 U4.31
MGT_TX_P_1: JP3.33 U4.9
MGT_TX_P_2: JP3.7 U4.35
MGT_TX_P_3: JP3.25 U4.17
PHY2_MDI0N: D5.4(I/O_3) D5.7(NC) RJ1.3(MDI0-) U12.10(TXN0)
PHY2_MDI0P: D5.5(I/O_4) D5.6(NC) RJ1.2(MDI0+) U12.9(TXP0)
PHY2_MDI1N: D5.1(I/O_1) D5.10(NC) RJ1.7(MDI1-) U12.13(TXN1)
PHY2_MDI1P: D5.2(I/O_2) D5.9(NC) RJ1.4(MDI1+) U12.12(TXP1)
PHY2_MDI2N: D4.4(I/O_3) D4.7(NC) RJ1.6(MDI2-) U12.16(TXN2)
PHY2_MDI2P: D4.5(I/O_4) D4.6(NC) RJ1.5(MDI2+) U12.15(TXP2)
PHY2_MDI3N: D4.1(I/O_1) D4.10(NC) RJ1.9(MDI3-) U12.19(TXN3)
PHY2_MDI3P: D4.2(I/O_2) D4.9(NC) RJ1.8(MDI3+) U12.18(TXP3)
PHY_RXCLK/PHYAD1: R68.2 R108.1 U12.31(RX_CLK)
PHY_RXCLK/PHYAD2: R70.2 R109.2 U12.30(RX_DV)
PHY_RXD0/RXDLY: R59.2 R102.2 R103.1 U12.29(RXD0)
PHY_RXD1/TXDLY: R61.2 R104.2 R105.1 U12.28(RXD1)
PHY_RXD2/PLLOFF: R62.2 R106.1 U12.26(RXD2)
PHY_RXD3/PHYD0: R64.2 R107.1 U12.25(RXD3)
RESET: SW6.2 U1.44
UART1_D+: R66.2 U14.1(UD+)
UART1_D-: R67.2 U14.2(UD-)
UART2_D+: R63.2 U15.1(UD+)
UART2_D-: R65.2 U15.2(UD-)
USB_DM: U13.10(UDM) USBC1.A7(DN1) USBC1.B7(DN2)
USB_DP: U13.11(UDP) USBC1.A6(DP1) USBC1.B6(DP2)
XADC_V_N: R47.2 U4.2
XADC_V_P: R39.2 U4.4
Net1_2: 1.2 2.2 FB1.2 IC1.11(DOVDD)
Net4_2: 4.2 IC1.5(SCL) R83.1 R87.1
Net5_2: 5.2 FB3.2 X3.4(VCC)
Net6_2: 6.2 IC1.3(SDA) R85.1 R86.1
Net7_2: 7.2 8.2 FB4.1 U16.3(VIN)
Net11_2: 11.2 12.2 FB5.1 U17.3(VIN)
Net15_2: 15.2 16.2 FB8.1 U18.3(VIN)
NetC6_1: C6.1 R23.1 U10.2(XCSO) X1.1
NetC7_1: C7.1 R23.2 U10.1(XCSI) X1.3
NetC9_2: C9.2 F1.1 U8.1(OUT)
NetC11_2: C11.2 Q2.1(G) R15.2 R16.1
NetC14_1: C14.1 RJ1.1(P1) RJ1.10(P10)
NetC17_1: C17.1 U10.38(VCORE)
NetC18_1: C18.1 U10.37(VCCA)
NetC19_2: C19.2 R32.1 U10.34(RESET#)
NetC20_1: C20.1 R37.1 R39.1 R40.2
NetC28_2: C28.2 C29.2 C30.2 FB2.1 U12.6(AVDDL) U12.11(AVDDL) U12.17(AVDDL)
NetC31_1: C31.1 U13.15(XIN) X2.3
NetC32_1: C32.1 U13.16(XOUT) X2.1
NetC33_2: C33.2 C34.2 C35.2 FB2.2 L1.2 U12.38(DVDDL)
NetC38_2: C38.2 U12.5(XTL_IN) X4.3
NetC39_2: C39.2 U12.4(XTL_OUT) X4.1
NetC41_2: C41.2 R98.2 R100.2 U12.1(RESET_N)
NetD3_1: D3.1(A) R9.1
NetD3_3: D3.3(K) HDMI_A1.13(CEC)
NetHDMI_A1_19: HDMI_A1.19(HOT_PLUG) R11.2 R13.2 U5.3(A2)
NetIC1_13: IC1.13(XVCLK) X3.3(OUT)
NetL1_1: L1.1 U12.2(LX)
NetLED1_1: LED1.1(A) R48.1
NetLED2_1: LED2.1(A) R49.1
NetLED3_1: LED3.1(A) R50.1
NetLED4_1: LED4.1(A) R51.1
NetLED5_1: LED5.1(A) R52.1
NetLED6_1: LED6.1(A) R53.1
NetLED7_1: LED7.1(A) R54.1
NetQ1_1: Q1.1(G) R17.2
NetQ3_1: Q3.1(G) R27.2
NetR12_1: R12.1 U5.4(Y2)
NetR13_1: R13.1 U6.4(Y)
NetR14_1: R14.1 R19.2 U9.1(DO)
NetR18_2: R18.2 U8.3(OC)
NetR25_2: R25.2 RJ1.11
NetR26_2: R26.2 RJ1.14
NetR28_2: R28.2 U10.5(REF)
NetR31_2: R31.2 U10.13(ADBUS0)
NetR33_2: R33.2 U10.14(ADBUS1)
NetR34_2: R34.2 U10.15(ADBUS2)
NetR35_2: R35.2 U10.16(ADBUS3)
NetR58_2: R58.2 U13.9(REXT)
NetR60_1: R60.1 U12.7(RBIAS)
NetR63_1: R63.1 U13.6(DP3)
NetR65_1: R65.1 U13.5(DM3)
NetR66_1: R66.1 U13.4(DP2)
NetR67_1: R67.1 U13.3(DM2)
NetR69_1: R69.1 U13.2(DP1)
NetR71_1: R71.1 U13.1(DM1)
NetR72_1: R72.1 U14.9(RXD)
NetR73_1: R73.1 U14.8(TXD)
NetR76_1: R76.1 U15.9(RXD)
NetR77_2: R77.2 R81.2 U12.40(MDC)
NetR78_1: R78.1 U15.8(TXD)
NetR79_2: R79.2 R80.2 U12.39(MDIO)
NetR82_2: R82.2 TP2.1 U12.20(INT)
NetR84_1: R84.1 X3.1(EN/NC)
NetTP1_1: TP1.1 U12.23(CLK_25M)
NetU13_7: U13.7(DM4) USB1.2(D-)
NetU13_8: U13.8(DP4) USB1.3(D+)

Not connected (* = marked no-connect by the designer): HDMI_A1 14(NC)*; R40 3*; U5 1(A1)* 6(Y1)*; U7 4(NC)*; U10 17(ADBUS4)* 18(ADBUS5)* 19(ADBUS6)* 20(ADBUS7)* 21(ACBUS0)* 25(ACBUS1)* 26(ACBUS2)* 27(ACBUS3)* 28(ACBUS4)* 29(ACBUS5)* 30(ACBUS6)* 31(ACBUS7)* 32(ACBUS8)* 33(ACBUS9)* 42(TEST)*; U14 4(RTS#)* 5(CTS#)* 6(TNOW)*; U15 4(RTS#)* 5(CTS#)* 6(TNOW)*; USBC1 A5(CC1)* A8(SBU1)* B5(CC2)* B8(SBU2)*

### Notes on the sheet
- 差分阻抗
- 单端阻抗
- (near U4) IO
- HDMI
- 电源
- XADC
- JTAG
- SD
- 磁珠/500Ω ±25% @100MHz 150MA
- 按键和灯
- USB集线器
- (near L1) trace length<0.5cm
- UART
- (near FB4) 磁珠/500Ω ±25% @100MHz 150MA
- (near FB5) 磁珠/500Ω ±25% @100MHz 150MA
- (near FB8) 磁珠/500Ω ±25% @100MHz 150MA
- LCD
- 摄像头
- (near JP3) 接口
- 网口
- (in symbol HR911130C) 绿?; 黄?
- (in symbol OV5640) IO口电压; 传感器核心电压; 模拟电压; 对焦电机电压; 500万像素

### Library data of the parts
1-18 C1-C48 = C: 贴片电容/MLCC电容
*1-*8 = M3: 铜柱孔
D3 = Diode BAS16: Silicon Switching Diode for High-Speed Switching
FB1-FB8 = FB: 贴片磁珠
HDMI_A1 = HDMI_A
JP1 JP2 = Header 14X2: 14*2P接插件
JP3 JP4 = Header 20X2: 20*2P接插件
L1 = L: 贴片小功率电感
LED1-LED7 = LED: 贴片LED
R1-R39 R41-R109 = R: 贴片电阻
R40 = RV09_RV0932
RGB_TFTLCD? = FPC-40: FPC-40P-0.5mm
RJ1 = HR911130C: RJ45 + MAG
TP1 TP2 = TEST: 测试点
U7 = ME6211C33: LDO 3.3V/0.5A
U11 = Micro SD: Micro SD卡
U12 = YT8511C/H: 千兆以太网PHY
U18 = LN6206P282MR-G
USB1 = USB2.0_Type-A_F: USB2.0_Type-A母座
USBC1 = USB2.0_Type-C_16Pin: USB2.0_Type-C_16Pin母座
X1 X2 X4 = XTAL-4P: 4脚无源晶振(谐振器）
X3 = XTAL-ACT-4P: 4脚有源晶振(振荡器)